# EAGLE design OSO-MISC-21-018 Temperature Board (EAGLE 9.6.2)
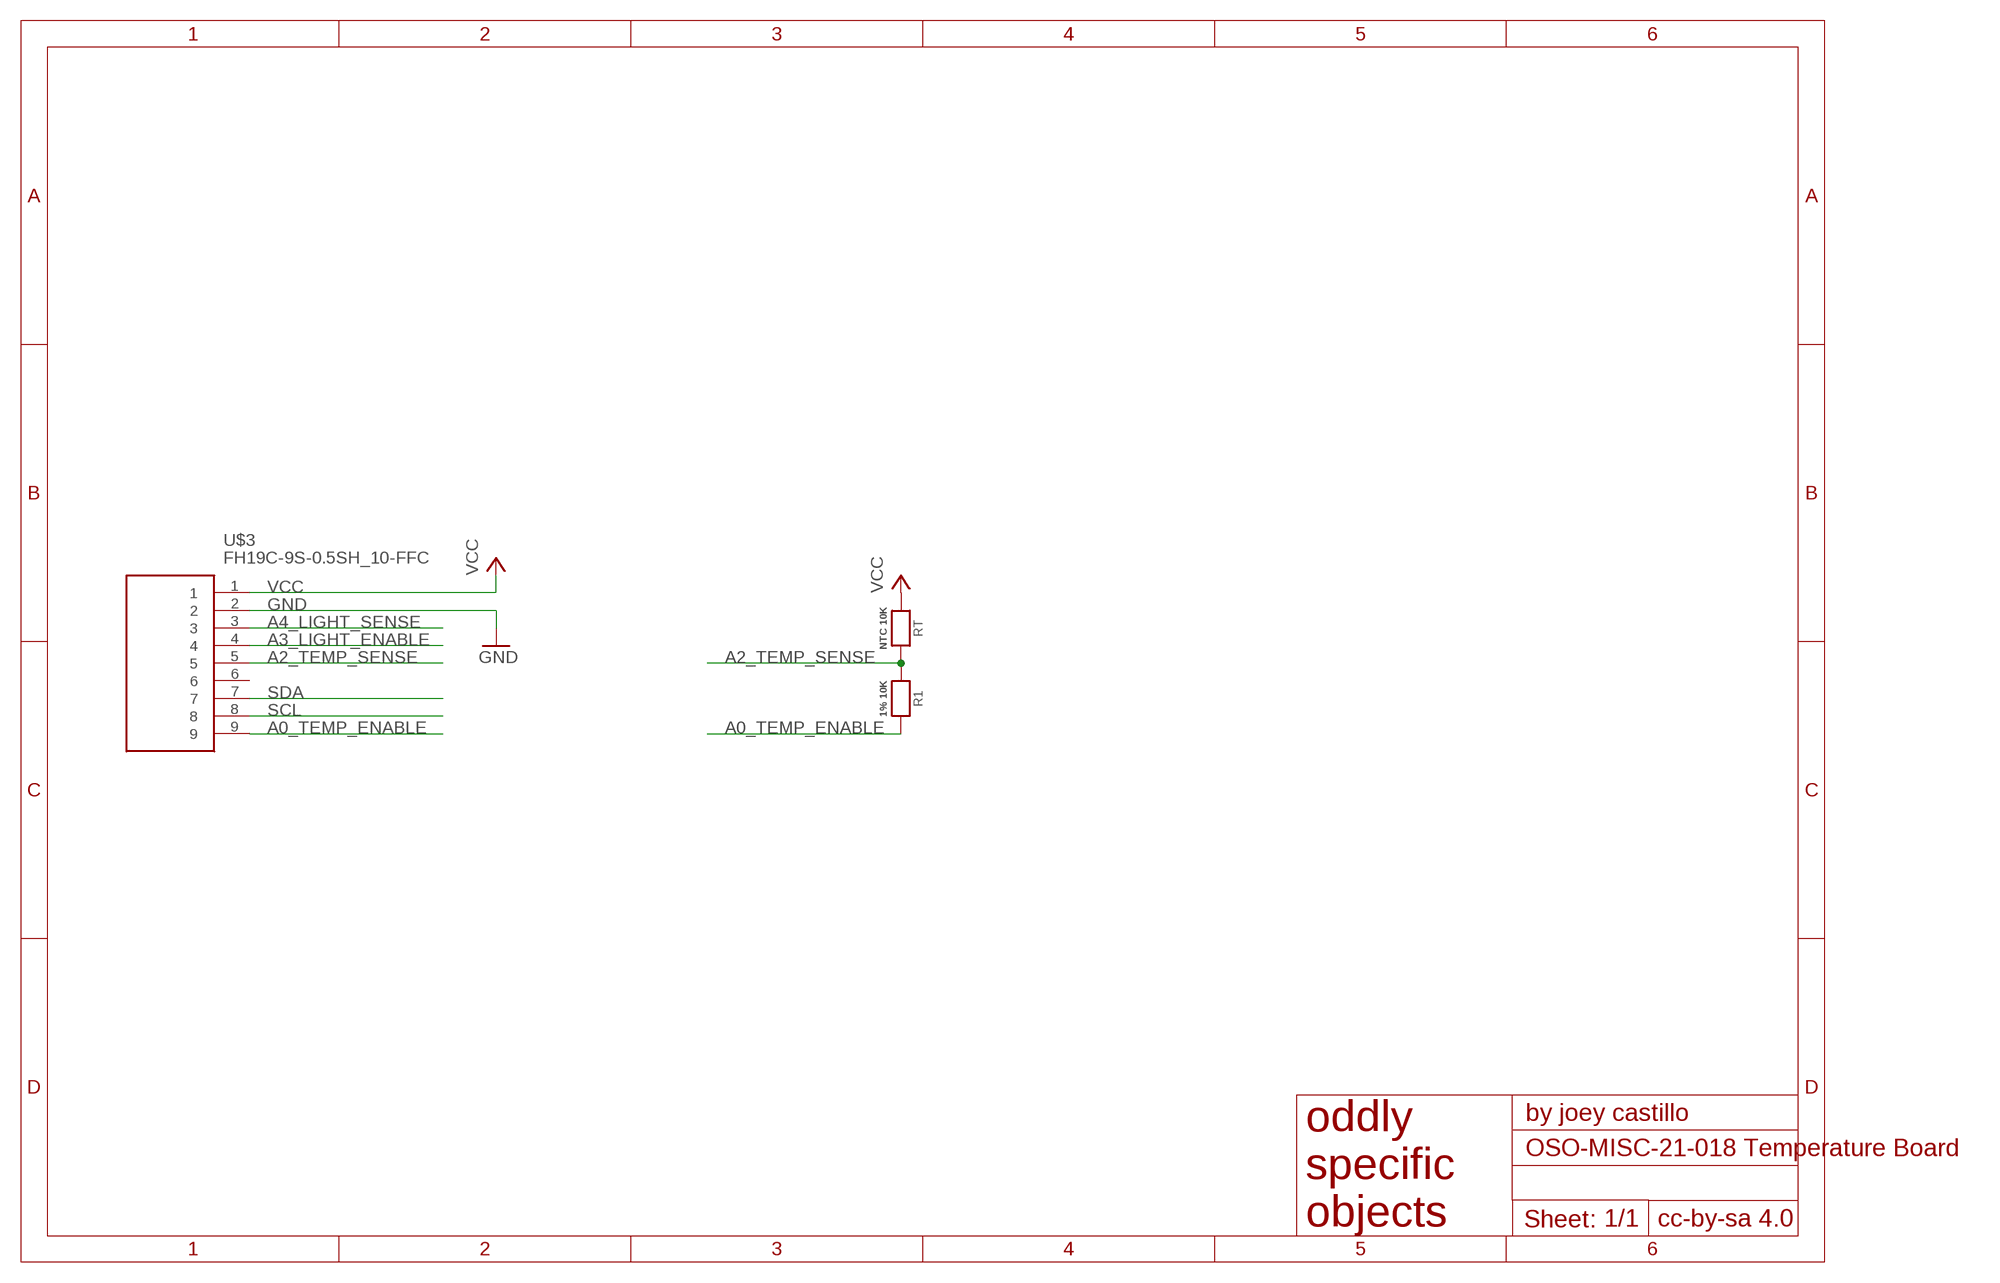
[diagram p0: schematic, sheet 1]

## Parts
R1  1% 10K  RESISTOR_0603MP  [_0603MP]
RT  NTC 10K  RESISTOR_0603  [_0603]
U$3  FH19C-9S-0.5SH_10-FFC  [FH19C9S05SH10-FFC]

## Nets
A0_TEMP_ENABLE: R1.2 U$3.9
A2_TEMP_SENSE: R1.1 RT.2 U$3.5
A3_LIGHT_ENABLE: U$3.4
A4_LIGHT_SENSE: U$3.3
GND [gnd]: U$3.2
SCL: U$3.8
SDA: U$3.7
VCC [power]: RT.1 U$3.1
Unconnected: U$3.6

## Library data of the parts
R1 RT = microbuilder:RESISTOR: Resistors For new designs, use the packages preceded by an '_' character since they are more reliable: The following footprints should be used on most boards: _0402 - Standard footprint for regular board layouts _0603 - Standard footprint for regular board layouts _0805 - Standard footprint for regular board layouts _1206 - Standard footprint for regular board layouts For extremely tight-pitch boards where space is at a premium, the following 'micro-pitch' footprints can be used (smaller pads, no silkscreen outline, etc.): _0402MP - Micro-pitch footprint for very dense/compact boards _0603MP - Micro-pitch footprint for very dense/compact boards _0805MP - Micro-pitch footprint for very dense/compact boards _1206MP - Micro-pitch footprint for very dense/compact boards
U$3 = FH19C-9S-0.5SH:FH19C-9S-0.5SH_10-FFC

## Net classes
0 default: width 0.203 mm
1 power: width 0.203 mm
2 gnd: width 0.203 mm

## Board
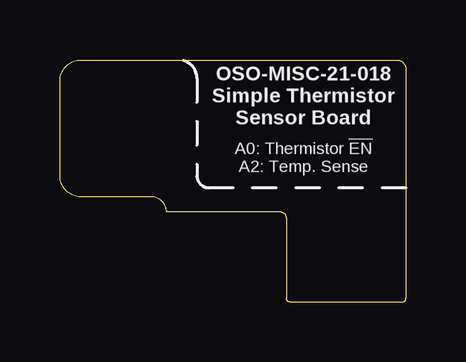
[diagram p1: board, top side]
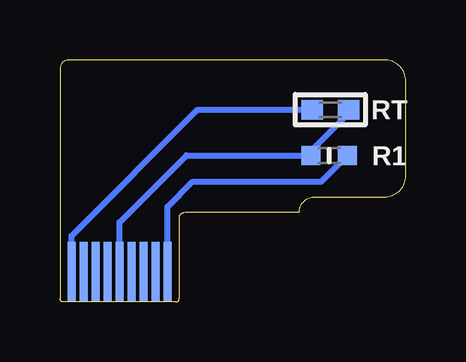
[diagram p2: board, bottom side, seen from below]

Size 14.43 x 10.1 mm. Coordinates in mm from the lower left corner, seen from the top.
Outline: 9.45,3.5 arc90 9.2,3.75 4.45,3.75 arc90 3.81,4.39 0.89,4.39 arc-90 0,5.28 0,9.21 arc-90 0.89,10.1 14.05,10.1 arc-90 14.43,9.72 14.43,3.5
Copper layers (1*16): Top 0.035559375mm / dielectric 1.6mm / Bottom 0.035559375mm
Design rules "oshpark-2layer *": minimum track width 6mil, minimum drill 10mil, track to track 6mil, track to pad 6mil, pad to pad 6mil, via to via 6mil, smd to smd 6mil, copper to edge 15mil, drill to drill 6mil, minimum pad ring 5mil, minimum via ring 5mil, stop-mask expansion 2.5mil, vias tented up to drill 12mil, thermal gap 10mil

### Footprints (pad centres in the part's own frame; a part is rotated, then mirrored left to right if it is on the bottom)
_0603MP = smd 0.8 x 0.8: 1 -0.762,0; 2 0.762,0
_0603 = smd 0.9 x 0.8: 1 -0.762,0; 2 0.762,0
FH19C9S05SH10-FFC = smd 0.347 x 2.5 bottom: 1 2,-2.25; 2 1.5,-2.25; 3 1,-2.25; 4 0.5,-2.25; 5 0,-2.25; 6 -0.5,-2.25; 7 -1,-2.25; 8 -1.5,-2.25; 9 -2,-2.25

### Placement (x,y rotation side)
R1  3.2,6.12 0 bottom
RT  3.15,8.02 0 bottom
U$3  11.94,3.5 0 top

### Tracks (layer width: path | path; a pad name or v marks a point on that pad's centre or on a via)
A0_TEMP_ENABLE
  Bottom 0.254: U$3.9 9.94,3.98 8.89,5.02 3.53,5.02 R1.2
A2_TEMP_SENSE
  Bottom 0.254: U$3.5 11.94,3.33 9.15,6.12 R1.1 3.96,6.29 2.39,7.87 RT.2
VCC
  Bottom 0.254: U$3.1 13.94,2.77 8.69,8.02 RT.1

### Text on the board
tPlace: OSO-MISC-21-018 / Simple Thermistor / Sensor Board | A0: Thermistor !EN / A2: Temp. Sense